# EAGLE design controller (EAGLE 7.1.0)
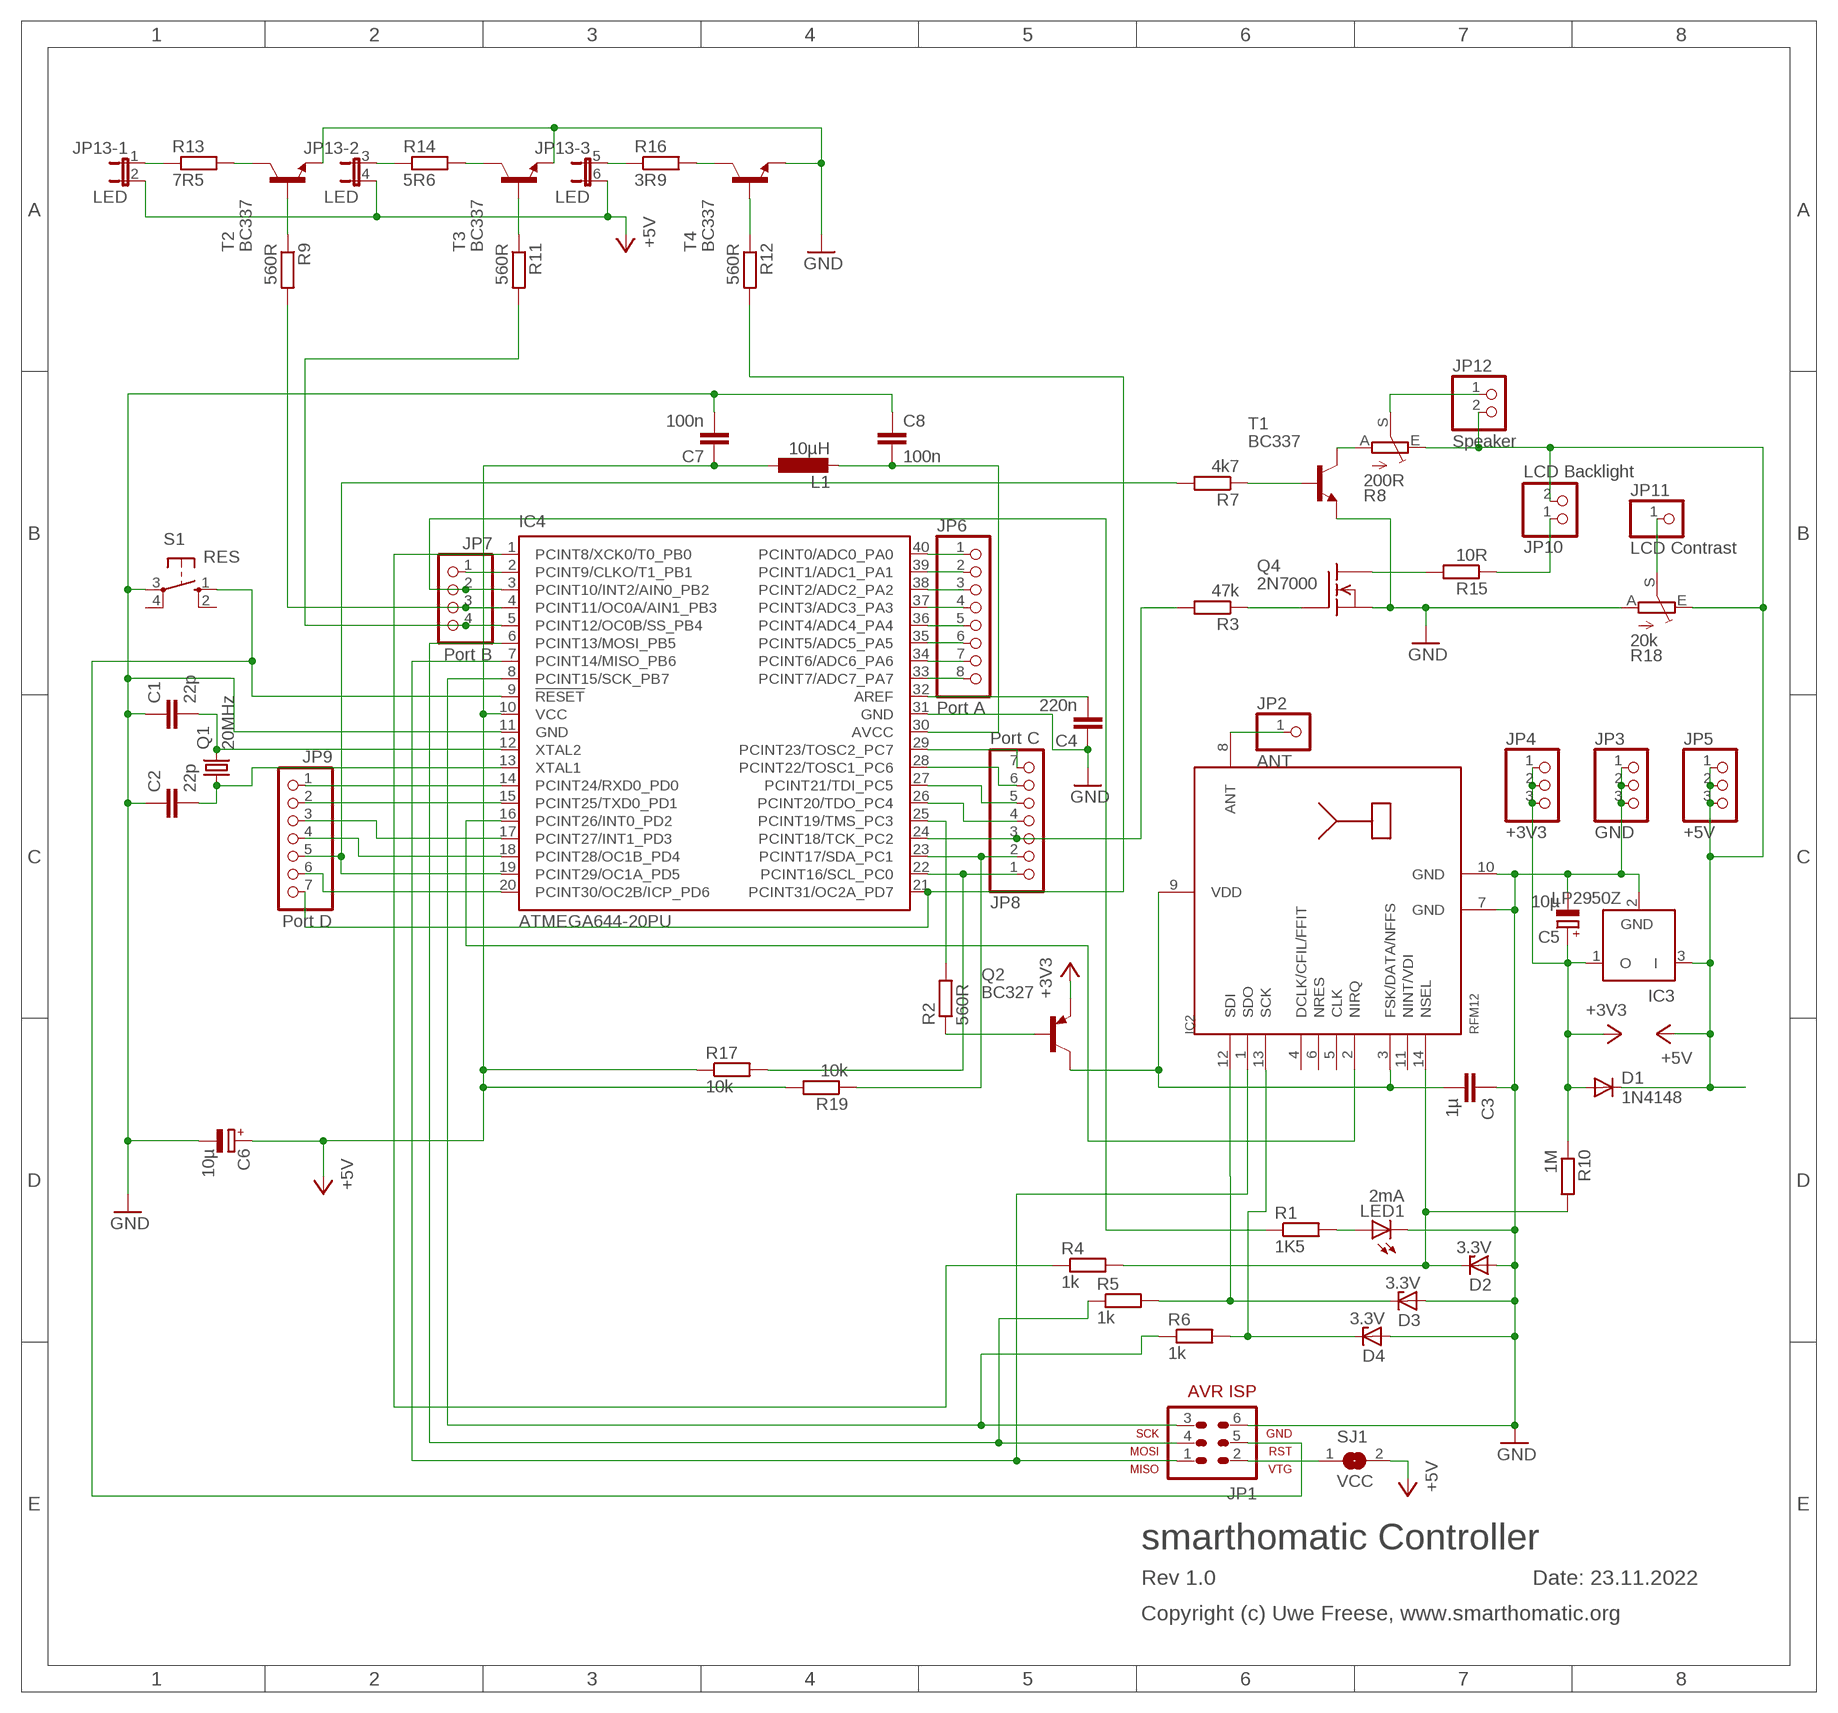
[diagram p0: schematic, sheet 1]

## Parts
C1  22p  C-EU025-024X044  [C025-024X044]
C2  22p  C-EU025-024X044  [C025-024X044]
C3  1µ  C-EU025-030X050  [C025-030X050]
C4  220n  C-EU025-030X050  [C025-030X050]
C5  10µ  CPOL-EUE1.8-4  [E1,8-4]
C6  10µ  CPOL-EUE1.8-4  [E1,8-4]
C7  100n  C-EU050-024X044  [C050-024X044]
C8  100n  C-EU050-024X044  [C050-024X044]
D1  1N4148  1N4148DO35-7  [DO35-7]
D2  3.3V  ZENER-DIODEZD-5  [ZDIO-5]
D3  3.3V  ZENER-DIODEZD-5  [ZDIO-5]
D4  3.3V  ZENER-DIODEZD-5  [ZDIO-5]
IC2  RFM12  [RFM]
IC3  LP2950Z  [TO92]
IC4  ATMEGA644-20PU  [DIL40]
JP1  AVR-ISP-6  [AVR-ISP-6]
JP2  ANT  PINHD-1X1  [1X01]
JP3  GND  PINHD-1X3  [1X03]
JP4  +3V3  PINHD-1X3  [1X03]
JP5  +5V  PINHD-1X3  [1X03]
JP6  Port A  PINHD-1X8  [1X08]
JP7  Port B  PINHD-1X4  [1X04]
JP8  Port C  PINHD-1X7  [1X07]
JP9  Port D  PINHD-1X7  [1X07]
JP10  LCD Backlight  PINHD-1X2  [1X02]
JP11  LCD Contrast  PINHD-1X1  [1X01]
JP12  Speaker  PINHD-1X2  [1X02]
JP13  LED  JP3QE  [JP3Q]
L1  10µH  L-EU0207/10  [0207/10]
LED1  2mA  LED3MM  [LED3MM]
Q1  20MHz  CRYSTALHC49S  [HC49/S]
Q2  BC327  [TO92]
Q4  2N7000  TN0602N3  [TO-92]
R1  1K5  R-EU_0207/7  [0207/7]
R2  560R  R-EU_0207/7  [0207/7]
R3  47k  R-EU_0207/7  [0207/7]
R4  1k  R-EU_0207/7  [0207/7]
R5  1k  R-EU_0207/7  [0207/7]
R6  1k  R-EU_0207/7  [0207/7]
R7  4k7  R-EU_0207/7  [0207/7]
R8  200R  TRIM_EU-CA9H  [CA9H]
R9  560R  R-EU_0207/7  [0207/7]
R10  1M  R-EU_0207/7  [0207/7]
R11  560R  R-EU_0207/7  [0207/7]
R12  560R  R-EU_0207/7  [0207/7]
R13  7R5  R-EU_0207/7  [0207/7]
R14  5R6  R-EU_0207/7  [0207/7]
R15  10R  R-EU_0207/7  [0207/7]
R16  3R9  R-EU_0207/7  [0207/7]
R17  10k  R-EU_0207/7  [0207/7]
R18  20k  TRIM_EU-CA9H  [CA9H]
R19  10k  R-EU_0207/7  [0207/7]
S1  RES  10-XX  [B3F-10XX]
SJ1  VCC  SJ  [SJ]
T1  BC337  [TO92]
T2  BC337  [TO92]
T3  BC337  [TO92]
T4  BC337  [TO92]

## Nets
+3V3: C5.+ D1.A IC3.1(O) JP4.1 JP4.2 JP4.3 Q2.1(E) R10.1
+5V: C6.+ C7.1 D1.C IC3.3(I) IC4.10(VCC) JP5.1 JP5.2 JP5.3 JP10.2 JP12.2 JP13.2 JP13.4 JP13.6 L1.1 R8.E R17.1 R18.E R19.2 SJ1.2
GND: C1.1 C2.1 C3.1 C4.1 C5.- C6.- C7.2 C8.1 D2.A D3.A D4.A IC2.7(GND) IC2.10(GND) IC3.2(GND) IC4.11(GND) IC4.31(GND) JP1.6 JP3.1 JP3.2 JP3.3 LED1.K(C) Q4.1(S) R18.A S1.3(P) T1.1(E) T2.1(E) T3.1(E) T4.1(E)
N$1: C1.2 IC4.12(XTAL2) Q1.2
N$2: C2.2 IC4.13(XTAL1) Q1.1
N$3: IC4.6(PCINT13/MOSI_PB5) JP1.4 R5.1
N$4: IC2.1(SDO) IC4.7(PCINT14/MISO_PB6) JP1.1
N$5: D4.C IC2.13(SCK) R6.2
N$6: C4.2 IC4.32(AREF)
N$7: IC4.8(PCINT15/SCK_PB7) JP1.3 R6.1
N$8: IC4.9(!RESET) JP1.5 S1.1(S)
N$9: IC4.2(PCINT9/CLKO/T1_PB1) JP7.1
N$10: IC4.40(PCINT0/ADC0_PA0) JP6.1
N$11: IC4.39(PCINT1/ADC1_PA1) JP6.2
N$12: LED1.A R1.2
N$13: IC4.26(PCINT20/TDO_PC4) JP8.4
N$14: IC4.38(PCINT2/ADC2_PA2) JP6.3
N$15: IC2.2(NIRQ) IC4.16(PCINT26/INT0_PD2)
N$16: D3.C IC2.12(SDI) R5.2
N$17: IC4.37(PCINT3/ADC3_PA3) JP6.4
N$18: JP1.2 SJ1.1
N$19: IC4.36(PCINT4/ADC4_PA4) JP6.5
N$20: IC4.35(PCINT5/ADC5_PA5) JP6.6
N$21: IC4.29(PCINT23/TOSC2_PC7) JP8.7
N$22: IC4.34(PCINT6/ADC6_PA6) JP6.7
N$23: IC4.33(PCINT7/ADC7_PA7) JP6.8
N$24: IC4.3(PCINT10/INT2/AIN0_PB2) JP7.2 R1.1
N$25: IC2.8(ANT) JP2.1
N$26: IC4.1(PCINT8/XCK0/T0_PB0) R4.1
N$27: D2.C IC2.14(NSEL) R4.2 R10.2
N$28: IC4.25(PCINT19/TMS_PC3) R2.2
N$29: Q2.2(B) R2.1
N$30: IC4.4(PCINT11/OC0A/AIN1_PB3) JP7.3 R9.2
N$31: IC4.5(PCINT12/OC0B/SS_PB4) JP7.4 R11.2
N$32: C3.2 IC2.3(FSK/DATA/NFFS) IC2.9(VDD) Q2.3(C)
N$33: IC4.22(PCINT16/SCL_PC0) JP8.1 R17.2
N$34: IC4.23(PCINT17/SDA_PC1) JP8.2 R19.1
N$35: IC4.24(PCINT18/TCK_PC2) JP8.3 R3.2
N$36: IC4.19(PCINT29/OC1A_PD5) JP9.5 R7.2
N$38: IC4.28(PCINT22/TOSC1_PC6) JP8.6
N$39: IC4.20(PCINT30/OC2B/ICP_PD6) JP9.6
N$40: IC4.14(PCINT24/RXD0_PD0) JP9.1
N$41: IC4.15(PCINT25/TXD0_PD1) JP9.2
N$42: IC4.17(PCINT27/INT1_PD3) JP9.3
N$43: IC4.18(PCINT28/OC1B_PD4) JP9.4
N$44: IC4.21(PCINT31/OC2A_PD7) JP9.7 R12.2
N$45: IC4.27(PCINT21/TDI_PC5) JP8.5
N$46: C8.2 IC4.30(AVCC) L1.2
N$47: R7.1 T1.2(B)
N$49: R8.A T1.3(C)
N$50: JP12.1 R8.S
N$51: Q4.2(G) R3.1
N$52: Q4.3(D) R15.2
N$53: JP10.1 R15.1
N$54: JP11.1 R18.S
N$55: R9.1 T2.2(B)
N$56: R11.1 T3.2(B)
N$57: R12.1 T4.2(B)
N$61: JP13.1 R13.1
N$62: R13.2 T2.3(C)
N$63: JP13.3 R14.1
N$64: R14.2 T3.3(C)
N$65: JP13.5 R16.1
N$66: R16.2 T4.3(C)
Unconnected: IC2.4(DCLK/CFIL/FFIT) IC2.5(CLK) IC2.6(NRES) IC2.11(NINT/VDI) S1.2(S1) S1.4(P1)

## Notes on the sheet
- smarthomatic Controller
- Rev 1.0 | Date: 23.11.2022
- Copyright (c) Uwe Freese, www.smarthomatic.org

## Library data of the parts
C1-C4 C7 C8 = rcl:C-EU: CAPACITOR, European symbol
C5 C6 = rcl:CPOL-EU: POLARIZED CAPACITOR, European symbol
D1 = diode:1N4148: DIODE high speed (Philips)
D2-D4 = diode:ZENER-DIODE: Z-Diode
IC2 = hopeRF:RFM12
IC3 = linear:LP2950: 100 mA, Low Power Low Dropout Voltage Regulator Source: http://www.onsemi.com/pub/Collateral/LP2950-D.PDF
IC4 = atmel:ATMEGA644-*PU: 8-bit Microcontroller with 64K Bytes In-System Programmable Flash Auto generated by make-symbol-device-package-bsdl.ulp Rev. 34 Source: http://www.atmel.com/dyn/resources/prod_documents/doc2593.pdf; MPN: ATMEGA644-20PU; OC_FARNELL: 1288340; OC_NEWARK: 23M5060
JP1 = avr-5-4.16:AVR-ISP-6: AVR ISP-6 Serial Programming Header
JP2 JP11 = pinhead:PINHD-1X1: PIN HEADER
JP3-JP5 = pinhead:PINHD-1X3: PIN HEADER
JP6 = pinhead:PINHD-1X8: PIN HEADER
JP7 = pinhead:PINHD-1X4: PIN HEADER
JP8 JP9 = pinhead:PINHD-1X7: PIN HEADER
JP10 JP12 = pinhead:PINHD-1X2: PIN HEADER
JP13 = jumper:JP3QE: JUMPER
L1 = rcl:L-EU: INDUCTOR, European symbol
LED1 = led:LED: LED OSRAM: - CHIPLED LG R971, LG N971, LY N971, LG Q971, LY Q971, LO R971, LY R971 LH N974, LH R974 LS Q976, LO Q976, LY Q976 LO Q996 - Hyper CHIPLED LW Q18S LB Q993, LB Q99A, LB R99A - SideLED LS A670, LO A670, LY A670, LG A670, LP A670 LB A673, LV A673, LT A673, LW A673 LH A674 LY A675 LS A676, LA A676, LO A676, LY A676, LW A676 LS A679, LY A679, LG A679 - Hyper Micro SIDELED® LS Y876, LA Y876, LO Y876, LY Y876 LT Y87S - SmartLED LW L88C, LW L88S LB L89C, LB L89S, LG L890 LS L89K, LO L89K, LY L89K LS L896, LA L896, LO L896, LY L896 - TOPLED LS T670, LO T670, LY T670, LG T670, LP T670 LSG T670, LSP T670, LSY T670, LOP T670, LYG T670 LG T671, LOG T671, LSG T671 LB T673, LV T673, LT T673, LW T673 LH T674 LS T676, LA T676, LO T676, LY T676, LB T676, LH T676, LSB T676, LW T676 LB T67C, LV T67C, LT T67C, LS T67K, LO T67K, LY T67K, LW E67C LS E67B, LA E67B, LO E67B, LY E67B, LB E67C, LV E67C, LT E67C LW T67C LS T679, LY T679, LG T679 LS T770, LO T770, LY T770, LG T770, LP T770 LB T773, LV T773, LT T773, LW T773 LH T774 LS E675, LA E675, LY E675, LS T675 LS T776, LA T776, LO T776, LY T776, LB T776 LHGB T686 LT T68C, LB T68C - Hyper Mini TOPLED® LB M676 - Mini TOPLED Santana® LG M470 LS M47K, LO M47K, LY M47K Source: http://www.osram.convergy.de LUXEON: - LUMILED® LXK2-PW12-R00, LXK2-PW12-S00, LXK2-PW14-U00, LXK2-PW14-V00 LXK2-PM12-R00, LXK2-PM12-S00, LXK2-PM14-U00 LXK2-PE12-Q00, LXK2-PE12-R00, LXK2-PE12-S00, LXK2-PE14-T00, LXK2-PE14-U00 LXK2-PB12-K00, LXK2-PB12-L00, LXK2-PB12-M00, LXK2-PB14-N00, LXK2-PB14-P00, LXK2-PB14-Q00 LXK2-PR12-L00, LXK2-PR12-M00, LXK2-PR14-Q00, LXK2-PR14-R00 LXK2-PD12-Q00, LXK2-PD12-R00, LXK2-PD12-S00 LXK2-PH12-R00, LXK2-PH12-S00 LXK2-PL12-P00, LXK2-PL12-Q00, LXK2-PL12-R00 Source: www.luxeon.com KINGBRIGHT: KA-3528ASYC Source: www.kingbright.com
Q1 = crystal:CRYSTAL: CRYSTAL; OC_FARNELL: 1667008; OC_NEWARK: unknown
Q2 = transistor-pnp:BC327: PNP Transistor
Q4 = transistor-fet:TN0602N3: N-Channel Enhancement MOSFET 20V; 4A; 0,75Ohm
R1-R7 R9-R17 R19 = rcl:R-EU_: RESISTOR, European symbol
R8 R18 = pot:TRIM_EU-: POTENTIOMETER
S1 = switch-omron:10-XX: OMRON SWITCH; MPN: B3F-1000; OC_FARNELL: 176432; OC_NEWARK: 36M3542
SJ1 = jumper:SJ: SMD solder JUMPER
T1-T4 = transistor:BC337: NPN TRANSISTOR

## Net classes
0 default: clearance 0.305 mm

## Board
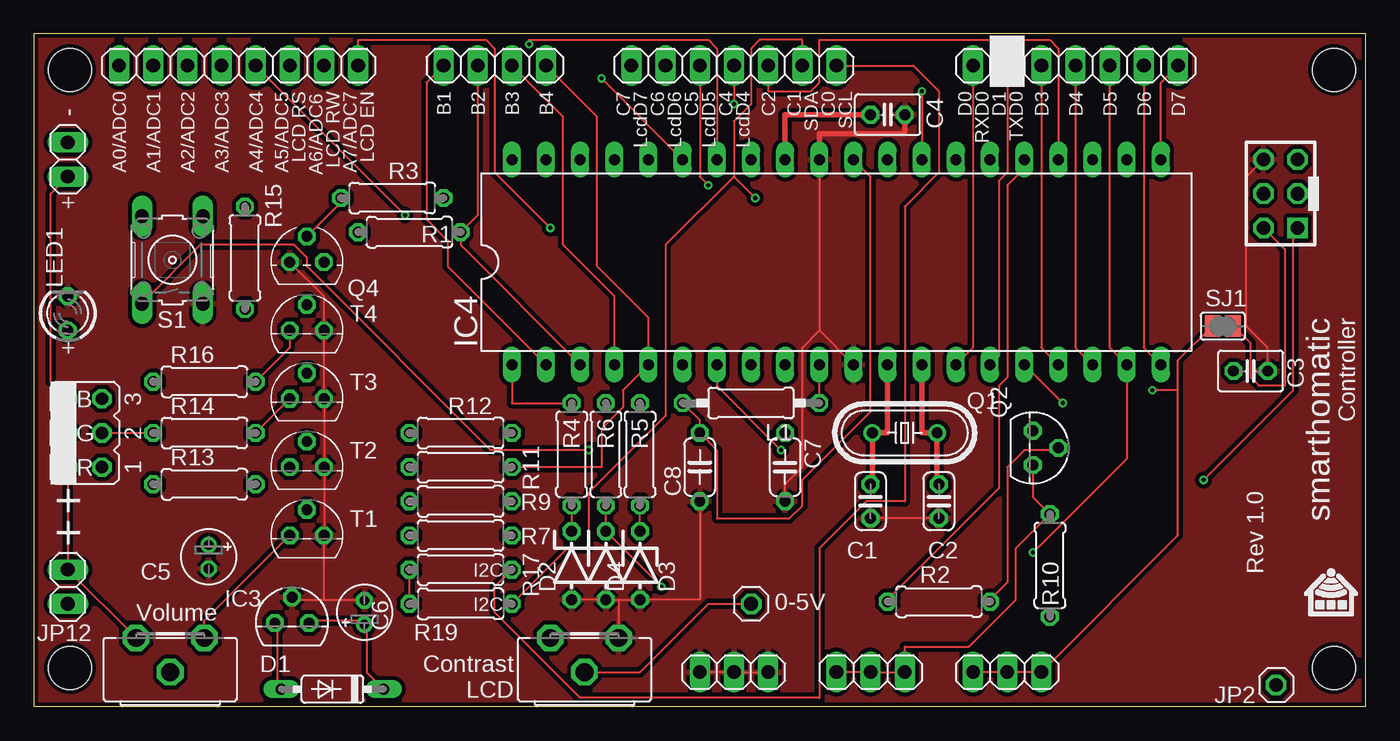
[diagram p1: board, top side]
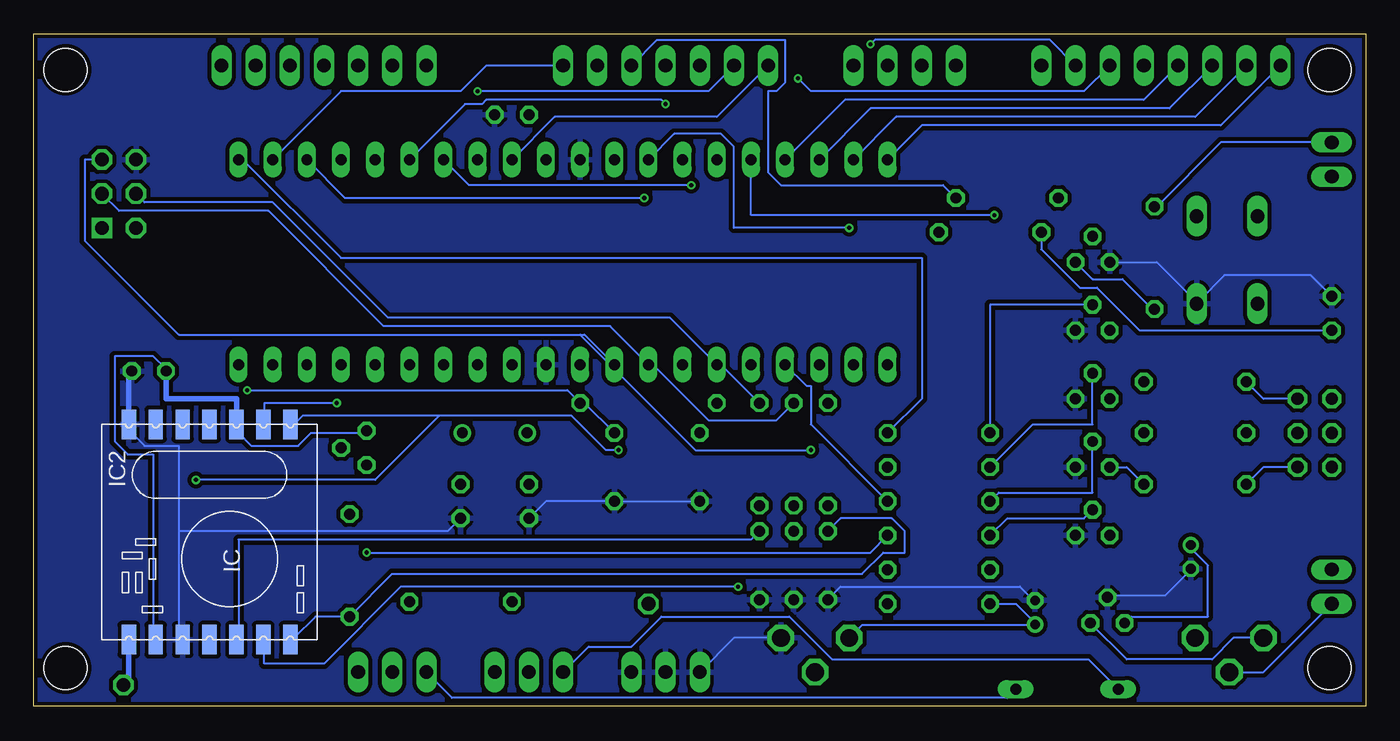
[diagram p2: board, bottom side, seen from below]

Size 99.06 x 50 mm. Coordinates in mm from the lower left corner, seen from the top.
Outline: 0,0 99.06,0 99.06,50 0,50 0,0
Copper layers (1*16): Top 0.035mm / dielectric 1.5mm / Bottom 0.035mm
Design rules "SeeedStudio_2layer_DRU_no_angle_20140221": minimum track width 6mil, minimum drill 12mil, track to track 6mil, track to pad 6mil, pad to pad 6mil, via to via 6mil, smd to smd 0mil, copper to edge 10mil, drill to drill 10mil, minimum pad ring 10mil, minimum via ring 6mil, stop-mask expansion 2mil, vias tented up to drill 100mil, thermal gap 10mil
Holes 3.2 mm at 2.7,47.31 96.68,47.31 96.68,2.86 2.7,2.86

### Footprints (pad centres in the part's own frame; a part is rotated, then mirrored left to right if it is on the bottom)
C025-024X044 = drill 0.813 octagon: 1 -1.27,0; 2 1.27,0
C025-030X050 = drill 0.813 octagon: 1 -1.27,0; 2 1.27,0
E1,8-4 = drill 0.711 pad 1.168: + -0.889,0 | drill 0.711 pad 1.168 octagon: - 0.889,0
C050-024X044 = drill 0.813 octagon: 1 -2.54,0; 2 2.54,0
DO35-7 = drill 0.813 long: A 3.81,0; C -3.81,0
ZDIO-5 = drill 0.813 octagon: A 2.54,0; C -2.54,0
RFM = smd 2.184 x 1.067: 1 0,14; 2 0,12; 3 0,10; 4 0,8; 5 0,6; 6 0,4; 7 0,2; 8 16,2; 9 16,4; 10 16,6; 11 16,8; 12 16,10; 13 16,12; 14 16,14
TO92 = drill 0.813 octagon: 1 -1.27,0; 2 0,1.905; 3 1.27,0
DIL40 = drill 0.813 long: 1 -24.13,-7.62; 2 -21.59,-7.62; 3 -19.05,-7.62; 4 -16.51,-7.62; 5 -13.97,-7.62; 6 -11.43,-7.62; 7 -8.89,-7.62; 8 -6.35,-7.62; 9 -3.81,-7.62; 10 -1.27,-7.62; 11 1.27,-7.62; 12 3.81,-7.62; 13 6.35,-7.62; 14 8.89,-7.62; 15 11.43,-7.62; 16 13.97,-7.62; 17 16.51,-7.62; 18 19.05,-7.62; 19 21.59,-7.62; 20 24.13,-7.62; 21 24.13,7.62; 22 21.59,7.62; 23 19.05,7.62; 24 16.51,7.62; 25 13.97,7.62; 26 11.43,7.62; 27 8.89,7.62; 28 6.35,7.62; 29 3.81,7.62; 30 1.27,7.62; 31 -1.27,7.62; 32 -3.81,7.62; 33 -6.35,7.62; 34 -8.89,7.62; 35 -11.43,7.62; 36 -13.97,7.62; 37 -16.51,7.62; 38 -19.05,7.62; 39 -21.59,7.62; 40 -24.13,7.62
AVR-ISP-6 = drill 1.016 square: 1 -2.54,-1.27 | drill 1.016 octagon: 2 -2.54,1.27; 3 0,-1.27; 4 0,1.27; 5 2.54,-1.27; 6 2.54,1.27
1X01 = drill 1.016 octagon: 1 0,0
1X03 = drill 1.016 long: 1 -2.54,0; 2 0,0; 3 2.54,0
1X08 = drill 1.016 long: 1 -8.89,0; 2 -6.35,0; 3 -3.81,0; 4 -1.27,0; 5 1.27,0; 6 3.81,0; 7 6.35,0; 8 8.89,0
1X04 = drill 1.016 long: 1 -3.81,0; 2 -1.27,0; 3 1.27,0; 4 3.81,0
1X07 = drill 1.016 long: 1 -7.62,0; 2 -5.08,0; 3 -2.54,0; 4 0,0; 5 2.54,0; 6 5.08,0; 7 7.62,0
1X02 = drill 1.016 long: 1 -1.27,0; 2 1.27,0
JP3Q = drill 0.914 octagon: 1 -2.54,-1.27; 2 -2.54,1.27; 3 0,-1.27; 4 0,1.27; 5 2.54,-1.27; 6 2.54,1.27
0207/10 = drill 0.813 octagon: 1 -5.08,0; 2 5.08,0
LED3MM = drill 0.813 octagon: A -1.27,0; K 1.27,0
HC49/S = drill 0.813: 1 -2.413,0; 2 2.413,0
TO92' = drill 0.813 octagon: 1 1.27,0; 2 0,1.905; 3 -1.27,0
TO-92 = drill 0.813 octagon: 1 -1.27,0; 2 0,1.905; 3 1.27,0
0207/7 = drill 0.813 octagon: 1 -3.81,0; 2 3.81,0
CA9H = drill 1.321 octagon: A -2.54,0; E 2.54,0; S 0,2.54
B3F-10XX = drill 1.016 long: 1 -3.251,2.261; 2 3.251,2.261; 3 -3.251,-2.261; 4 3.251,-2.261
SJ = smd 1.168 x 1.6: 1 -0.762,0; 2 0.762,0

### Placement (x,y rotation side)
C1  62.23,15.24 90 top
C2  67.31,15.24 90 top
C3  90.49,24.92 180 top
C4  63.5,43.97 180 top
C5  13.02,11.11 270 top
C6  24.61,6.99 90 top
C7  55.88,17.78 270 top
C8  49.53,17.78 90 top
D1  22.23,1.27 180 top
D2  40.01,10.48 270 top
D3  45.09,10.48 270 top
D4  42.55,10.48 270 top
IC2  93.98,20.95 270 bottom
IC3  19.21,6.19 0 top
IC4  59.69,33.02 0 top
JP1  92.71,38.1 90 top
JP2  92.39,1.59 0 top
JP3  52.07,2.54 180 top
JP4  62.23,2.54 0 top
JP5  72.39,2.54 0 top
JP6  15.24,47.62 0 top
JP7  34.29,47.62 0 top
JP8  52.07,47.62 180 top
JP9  77.47,47.62 0 top
JP10  2.54,40.64 270 top
JP11  53.34,7.62 0 top
JP12  2.54,8.89 90 top
JP13  3.81,20.32 90 top
L1  53.34,22.54 180 top
LED1  2.54,29.21 90 top
Q1  64.77,20.32 180 top
Q2  BC327  [TO92']  74.3,19.21 270 top
Q4  20.32,33.02 0 top
R1  27.94,35.24 180 top
R2  67.31,7.78 180 top
R3  26.67,37.78 0 top
R4  40.01,18.73 270 top
R5  45.09,18.73 270 top
R6  42.55,18.73 270 top
R7  31.75,12.7 0 top
R8  10.16,5.08 180 top
R9  31.75,15.24 0 top
R10  75.56,10.48 270 top
R11  31.75,17.78 0 top
R12  31.75,20.32 0 top
R13  12.7,16.51 0 top
R14  12.7,20.32 0 top
R15  15.72,33.34 270 top
R16  12.7,24.13 0 top
R17  31.75,10.16 0 top
R18  40.96,5.08 180 top
R19  31.75,7.62 180 top
S1  10.32,33.18 90 top
SJ1  88.42,28.26 180 top
T1  BC337  [TO92']  20.32,12.7 0 top
T2  BC337  [TO92']  20.32,17.78 0 top
T3  BC337  [TO92']  20.32,22.86 0 top
T4  BC337  [TO92']  20.32,27.94 0 top

### Tracks (layer width: path | path; a pad name or v marks a point on that pad's centre or on a via)
+3V3
  Top 0.152: D1.A 18.1,1.59 18.1,6.03 IC3.1 | Q2.1 74.3,15.56 R10.1 73.03,11.75 73.03,7.94 69.53,4.45 64.77,4.45 JP4.3 JP4.2 JP4.1
  Bottom 0.152: IC3.1 17.46,6.67 11.75,6.67 11.75,10.48 13.02,11.75 C5.+ | D1.A 20.64,3.49 39.69,3.49 42.86,6.67 52.39,6.67 54.61,4.45 57.78,4.45 JP4.1
+5V  (via drill 0.3)
  Top 0.152: L1.1 IC4.10 | JP5.1 JP5.2 JP5.3 85.09,12.7 85.09,23.5 | 85.09,23.5 85.09,25.72 87.63,28.26 SJ1.2 | 85.09,23.5 v83.19,23.5 | IC3.3 20.64,6.35 24.45,6.35 C6.+ 24.77,6.03 24.77,2.54 D1.C | R19.2 R17.1 | R8.E JP12.2 JP13.2 JP13.4 JP13.6 1.27,24.13 1.27,38.1 JP10.2
  Bottom 0.152: C7.1 58.1,22.54 L1.1 59.37,23.5 v83.19,23.5 | R19.2 26.04,7.62 24.77,6.35 C6.+ 24.77,6.03 37.47,6.03 R18.E | IC3.3 17.78,3.49 11.43,3.49 9.84,5.08 R8.E | JP5.1 67.94,0.64 26.67,0.64 D1.C
GND
  Top 0.152: 21.59,7.94 19.37,7.94 IC3.2 | 21.59,7.94 24.45,7.94 C6.- | 21.59,7.94 T1.1 T2.1 T3.1 T4.1 21.59,30.48 Q4.1 | JP1.6 90.17,39.37 90.17,28.26 91.76,26.67 C3.1 | JP3.3 JP3.2 JP3.1 | D2.A D4.A 43.5,7.94 | 43.5,7.94 D3.A 49.53,7.94 C8.1 | 43.5,7.94 R18.A | 58.42,27.94 IC4.11 | IC4.31 58.42,27.94 | C2.1 C1.1 | 58.42,27.94 57.15,26.67 57.15,17.78 55.88,16.51 C7.2
  Top 0.406: IC4.31 58.42,42.55 64.77,42.55 C4.1
  Bottom 0.152: C5.- 13.02,10.16 14.92,8.26 19.05,8.26 IC3.2 | LED1.K 4.13,32.07 10.48,32.07 12.38,30.16 S1.3 12.7,30.16 15.56,33.02 Q4.1 | 88.27,13.02 88.27,19.37 90.81,19.37 91.76,20.32 91.76,20.95 IC2.7 | 88.27,13.02 88.27,5.08 IC2.10 | JP3.3 46.99,5.08 R18.A | C8.1 C7.2 60.96,15.24 C1.1 | 88.27,13.02 68.26,13.02 C2.1 | D2.A 39.05,8.89 25.72,8.89 24.77,7.94 C6.-
  Bottom 0.406: C3.1 91.98,24.92 IC2.7
  pour Top (isolate 0.305): -2.54,52.07 101.6,52.07 101.6,-2.54 -2.54,-2.54
  pour Bottom (isolate 0.305): 0,50.8 100.33,50.8 100.33,-1.27 -1.27,-1.27 -1.27,50.8
N$1
  Top 0.406: IC4.12 63.5,20.32 Q1.2 62.36,16.51 C1.2
N$2
  Top 0.406: IC4.13 66.04,20.32 Q1.1 67.18,16.51 C2.2
N$3
  Bottom 0.152: R5.1 47.94,25.4 IC4.6 51.75,28.89 72.71,28.89 81.28,37.47 90.81,37.47 JP1.4
N$4  (via drill 0.3)
  Top 0.152: v55.56,19.05 50.8,23.81 IC4.7 | JP1.1 93.66,35.24 93.66,23.5 v87,16.83
  Bottom 0.152: 68.9,21.59 59.05,21.59 56.52,19.05 v55.56,19.05 | 68.9,21.59 79.06,21.59 79.69,20.95 IC2.1 | v87,16.83 73.66,16.83 68.9,21.59
N$5  (via drill 0.3)
  Top 0.152: v46.67,8.89 D4.C R6.2
  Bottom 0.152: v46.67,8.89 71.75,8.89 77.47,3.17 81.92,3.17 81.92,4.76 IC2.13
N$6
  Top 0.406: C4.2 55.88,43.97 IC4.32
N$7
  Bottom 0.152: R6.1 43.81,21.27 48.9,21.27 53.02,25.4 IC4.8 56.2,28.26 73.03,28.26 81.6,36.83 92.71,36.83 JP1.3
N$8  (via drill 0.3)
  Top 0.152: v41.27,19.05 33.97,19.05 20.32,32.7 20.32,33.34 19.37,34.29 12.38,34.29 8.26,30.16 S1.1
  Bottom 0.152: IC4.9 58.1,27.62 58.42,27.62 | 58.42,27.62 88.27,27.62 95.25,34.61 95.25,40.64 JP1.5 | v41.27,19.05 49.85,19.05 58.42,27.62
N$9
  Top 0.152: IC4.2 30.8,32.7 30.8,34.61 29.21,36.2 29.21,46.35 JP7.1
N$10
  Bottom 0.152: IC4.40 33.02,43.18 10.79,43.18 JP6.1
N$11
  Bottom 0.152: IC4.39 34.92,43.81 12.7,43.81 JP6.2
N$12
  Bottom 0.152: LED1.A 16.83,27.94 20,31.11 21.27,31.11 24.13,33.97 R1.2
N$13  (via drill 0.3)
  Top 0.152: JP8.4 v52.07,44.77
  Bottom 0.152: IC4.26 66.99,44.77 65.72,44.77 65.41,45.09 52.39,45.09 v52.07,44.77
N$14
  Bottom 0.152: IC4.38 36.83,44.45 14.61,44.45 JP6.3
N$15  (via drill 0.3)
  Top 0.152: IC4.16 v76.52,22.54
  Bottom 0.152: v76.52,22.54 81.92,22.54 81.92,20.95 IC2.2
N$16
  Top 0.152: D3.C R5.2
  Bottom 0.152: D3.C 45.72,12.38 83.82,12.38 83.82,5.08 IC2.12
N$17
  Bottom 0.152: IC4.37 38.73,45.09 16.51,45.09 JP6.4
N$18
  Top 0.152: JP1.2 93.03,33.97 93.03,23.81 91.12,23.81 90.49,24.45 90.49,26.99 89.22,28.26 SJ1.1
N$19  (via drill 0.3)
  Top 0.152: JP6.5 v27.62,36.51
  Bottom 0.152: IC4.36 45.72,36.51 v27.62,36.51
N$20  (via drill 0.3)
  Top 0.152: v42.23,46.67 IC4.35
  Bottom 0.152: v42.23,46.67 41.27,45.72 20.95,45.72 JP6.6
N$21
  Bottom 0.152: IC4.29 60.33,43.81 48.26,43.81 JP8.7
N$22  (via drill 0.3)
  Top 0.152: IC4.34 50.8,48.9 50.16,49.53 36.83,49.53 v36.83,49.21
  Bottom 0.152: v36.83,49.21 36.51,49.53 23.5,49.53 JP6.7
N$23  (via drill 0.3)
  Top 0.152: v38.42,35.56 34.29,39.69 34.29,48.9 33.66,49.53 24.13,49.53 JP6.8
  Bottom 0.152: IC4.33 51.44,42.55 47.94,42.55 46.99,41.59 46.99,35.56 v38.42,35.56
N$24
  Top 0.152: JP7.2 33.02,36.51 R1.1 31.75,34.29 IC4.3
N$25
  Bottom 0.406: JP2.1 91.98,1.59 IC2.8
N$26
  Top 0.152: R4.1 35.56,22.54 IC4.1
N$27
  Top 0.152: R4.2 D2.C
  Bottom 0.152: IC2.14 79.69,5.08 78.11,6.67 R10.2 72.39,9.84 37.47,9.84 35.88,11.43 34.29,11.43 34.29,13.02 35.24,13.97 39.05,13.97 D2.C
N$28
  Top 0.152: IC4.25 73.66,40.01 72.39,38.73 72.39,24.45 71.75,23.81 71.75,16.19 63.5,7.94 R2.2
N$29
  Top 0.152: R2.1 71.12,7.94 72.39,9.21 72.39,17.78 73.66,19.05 76.2,19.05 Q2.2
N$30
  Top 0.152: JP7.3 39.37,43.81 39.37,34.29 43.18,30.48 IC4.4
  Bottom 0.152: R9.2 41.27,20.95 41.27,23.81 41.59,23.81 IC4.4
N$31
  Top 0.152: R11.2 42.23,17.78 42.23,20.64 43.81,22.23 43.81,23.5 IC4.5 45.72,28.89 41.91,32.7 41.91,43.81 JP7.4
N$32
  Bottom 0.152: IC2.9 90.17,5.08 90.17,18.73 92.08,18.73 93.03,19.68 93.03,26.04 90.17,26.04 89.22,25.08 C3.2 | Q2.3 74.3,20.32 78.42,20.32 79.38,19.37 82.87,19.37 83.82,20.32 83.82,20.95 IC2.3
  Bottom 0.406: C3.2 89.22,22.86 83.98,22.86 IC2.3
N$33
  Top 0.152: R17.2 34.29,8.89 34.29,6.99 40.64,0.64 58.42,0.64 58.42,11.75 61.91,15.24 64.77,15.24 64.77,37.15 67.31,39.69 67.31,45.72 65.41,47.62 JP8.1
  Bottom 0.152: IC4.22 76.2,45.72 67.31,45.72 65.41,47.62 JP8.1
N$34  (via drill 0.3)
  Top 0.152: R19.1 39.69,11.75 41.27,11.75 41.27,15.88 46.99,21.59 46.99,34.29 52.07,39.37 | 52.07,39.37 52.07,43.5 53.34,44.77 53.34,48.9 53.98,49.53 57.15,49.53 JP8.2 | 52.07,39.37 v53.66,37.78
  Bottom 0.152: IC4.23 75.88,37.78 v53.66,37.78
N$35
  Top 0.152: IC4.24 76.2,48.9 75.56,49.53 58.42,49.53 58.42,46.35 57.78,45.72 54.61,45.72 JP8.3
  Bottom 0.152: R3.2 31.43,38.73 43.5,38.73 44.45,39.69 44.45,45.72 43.81,45.72 43.18,46.35 43.18,49.53 52.7,49.53 JP8.3
N$36  (via drill 0.3)
  Top 0.152: v74.3,11.43 81.28,18.41 IC4.19 80.01,26.67 JP9.5
  Bottom 0.152: R7.2 36.83,11.43 v74.3,11.43
N$38  (via drill 0.3)
  Top 0.152: v66.04,45.72 IC4.28
  Bottom 0.152: v66.04,45.72 48.9,45.72 JP8.6
N$39
  Top 0.152: IC4.20 82.55,26.67 JP9.6
N$40
  Top 0.152: IC4.14 69.85,26.67 JP9.1
N$41
  Top 0.152: IC4.15 71.75,26.04 71.75,39.05 72.39,39.69 JP9.2
N$42
  Top 0.152: IC4.17 74.93,26.67 JP9.3
N$43
  Top 0.152: IC4.18 77.47,26.67 JP9.4
N$44
  Top 0.152: JP9.7 83.82,46.35 IC4.21
  Bottom 0.152: R12.2 33.02,22.86 33.02,33.34 76.2,33.34 83.5,40.64 IC4.21
N$45  (via drill 0.3)
  Top 0.152: v50.16,38.73 49.53,39.37 JP8.5
  Bottom 0.152: IC4.27 66.67,38.73 v50.16,38.73
N$46
  Top 0.152: L1.2 49.53,21.27 C8.2 50.8,19.05 50.8,13.97 56.2,13.97 57.15,14.92 57.15,16.83 62.23,21.91 62.23,39.37 IC4.30
N$47
  Bottom 0.152: T1.2 20.95,13.97 26.67,13.97 R7.1
N$49
  Top 0.152: T1.3 12.7,6.35 R8.A
N$50
  Bottom 0.152: JP12.1 7.62,2.54 R8.S
N$51
  Top 0.152: Q4.2 22.86,37.47 R3.1
N$52
  Bottom 0.152: Q4.3 20.32,31.75 18.1,31.75 15.88,29.53 R15.2
N$53
  Bottom 0.152: JP10.1 10.79,41.91 15.56,37.15 R15.1
N$54
  Top 0.152: JP11.1 50.16,7.62 45.09,2.54 R18.S
N$55
  Bottom 0.152: T2.2 20.32,15.88 27.3,15.88 R9.1
N$56
  Bottom 0.152: T3.2 20.32,20.95 24.77,20.95 R11.1
N$57
  Bottom 0.152: R12.1 27.94,29.84 T4.2
N$61
  Bottom 0.152: R13.1 7.62,17.78 JP13.1
N$62
  Bottom 0.152: R13.2 17.78,17.78 T2.3
N$63
  Top 0.152: JP13.3 R14.1
N$64
  Top 0.152: T3.3 R14.2
N$65
  Bottom 0.152: R16.1 7.62,22.86 JP13.5
N$66
  Top 0.152: R16.2 19.05,26.67 T4.3

### Text on the board
tNames: A0/ADC0 | A1/ADC1 | A2/ADC2 | A3/ADC3 | A4/ADC4 | A5/ADC5 | LCD RS | A6/ADC6 | LCD RW | A7/ADC7 | LCD EN | B1 | B2 | B3 | B4 | C7 | LcdD7 | C6 | LcdD6 | C5 | LcdD5 | C4 | LcdD4 | C2 | C1 | SDA | C0 | SCL | D0 | RXD0 | D1 | TXD0 | D3 | D4 | D5 | D6 | D7 | - | + | smarthomatic | Controller | + | B | G | R | + | + | I2C | Rev 1.0 | I2C | 0-5V | Volume | Contrast | LCD